# EAGLE design MIDI_TESTER (EAGLE 9.5.2)
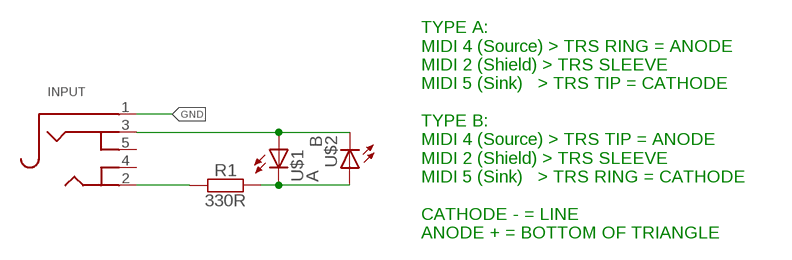
[diagram p0: schematic, sheet 1]

## Parts
INPUT  AUDIO_3.5MMJACK  [4UCONN_19269]
R1  330R  RESISTOR-0603  [C0603]
U$1  A  LED-1206-REVERSE_PLATEPLATED  [LED-1206-REVERSE-PLATED]
U$2  B  LED-1206-REVERSE_PLATEPLATED  [LED-1206-REVERSE-PLATED]

## Nets
GND: INPUT.1
N$1: INPUT.2 R1.1
N$2: INPUT.3 U$1.A U$2.C
N$3: R1.2 U$1.C U$2.A
Unconnected: INPUT.4 INPUT.5 U$1.HOLE_BOTTOM U$1.HOLE_TOP U$2.HOLE_BOTTOM U$2.HOLE_TOP

## Notes on the sheet
- TYPE A: 
  MIDI 4 (Source) > TRS RING = ANODE
  MIDI 2 (Shield) > TRS SLEEVE
  MIDI 5 (Sink)   > TRS TIP = CATHODE
  
  TYPE B: 
  MIDI 4 (Source) > TRS TIP = ANODE
  MIDI 2 (Shield) > TRS SLEEVE
  MIDI 5 (Sink)   > TRS RING = CATHODE
  
  CATHODE - = LINE 
  ANODE + = BOTTOM OF TRIANGLE

## Library data of the parts
INPUT = microbuilder:AUDIO_3.5MMJACK: 3.5MM Audio Jack These are normally connected as follows, from left-to right on the schematic symbol above: Tip: Left Audio Inner Ring: Right Audio Shell: Common/GND
R1 = we-rcl:RESISTOR: Resistors all kinds in 0402 and 0603
U$1 U$2 = MTM_untested:LED-1206-REVERSE_PLATE

## Board
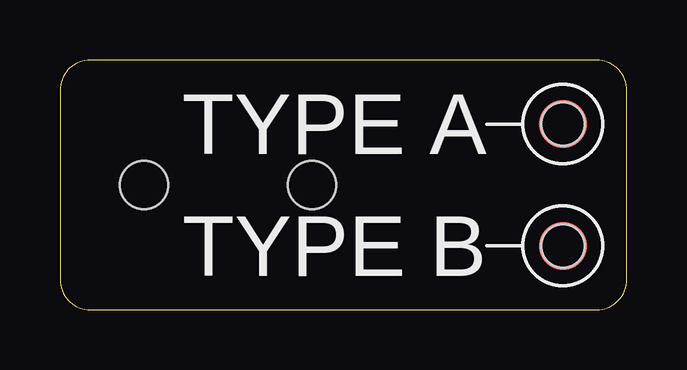
[diagram p1: board, top side]
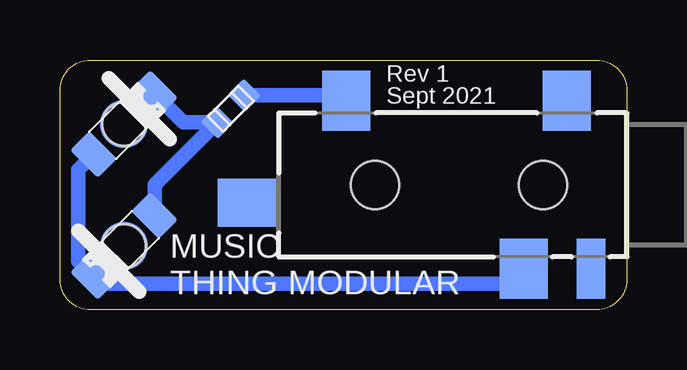
[diagram p2: board, bottom side, seen from below]

Size 23.62 x 10.41 mm. Coordinates in mm from the lower left corner, seen from the top.
Outline: 0,9.14 0,1.27 arc90 1.27,0 22.35,0 arc90 23.62,1.27 23.62,9.14 arc90 22.35,10.41 1.27,10.41 arc90 0,9.14
Copper layers (1*16): Top 0.0356mm / dielectric 1.5011mm / Bottom 0.0356mm
Design rules "oshpark-2layer": minimum track width 6mil, minimum drill 13mil, track to track 6mil, track to pad 6mil, pad to pad 6mil, via to via 6mil, smd to smd 6mil, copper to edge 15mil, drill to drill 6mil, minimum pad ring 7mil, minimum via ring 7mil, stop-mask expansion 2.5mil, vias tented up to drill 15mil, thermal gap 10mil

### Footprints (pad centres in the part's own frame; a part is rotated, then mirrored left to right if it is on the bottom)
4UCONN_19269 = smd 2 x 2.5: 1 2.5,-3.5; 2 11.7,-3.5; 3 4.3,3.5 | smd 2.5 x 2: 4 15.8,0.75 | smd 1.2 x 2.5: 5 1.5,3.5 | hole 2: 3.5,0; 10.5,0
C0603 = smd 1 x 0.95: 1 0,0.8; 2 0,-0.8
LED-1206-REVERSE-PLATED = smd 1.6 x 1.1 bottom: A 0,-1.8; C 0,1.8 | smd 2 x 2 bottom: HOLE_BOTTOM 0,0 | smd 2 x 2: HOLE_TOP 0,0 | hole 1.8: 0,0

### Placement (x,y rotation side)
INPUT  0,5.21 180 bottom
R1  16.51,8.38 315 bottom
U$1  20.95,7.75 45 top
U$2  20.95,2.67 225 top

### Tracks (layer width: path | path; a pad name or v marks a point on that pad's centre or on a via)
N$1
  Bottom 0.61: INPUT.2 11.94,8.95 R1.1
N$2
  Bottom 0.61: U$1.A 22.86,5.84 | 22.86,5.84 | 22.86,5.84 22.86,2.03 U$2.C 21.93,1.39 21.61,1.08 4.93,1.08 INPUT.3
N$3
  Bottom 0.61: U$1.C 18.48,7.82 R1.2 19.68,5.21 U$2.A

### Text on the board
tPlace: TYPE A | TYPE B
bPlace: Rev 1 / Sept 2021 | MUSIC / THING MODULAR